# Altium project PHONE.PrjPCB
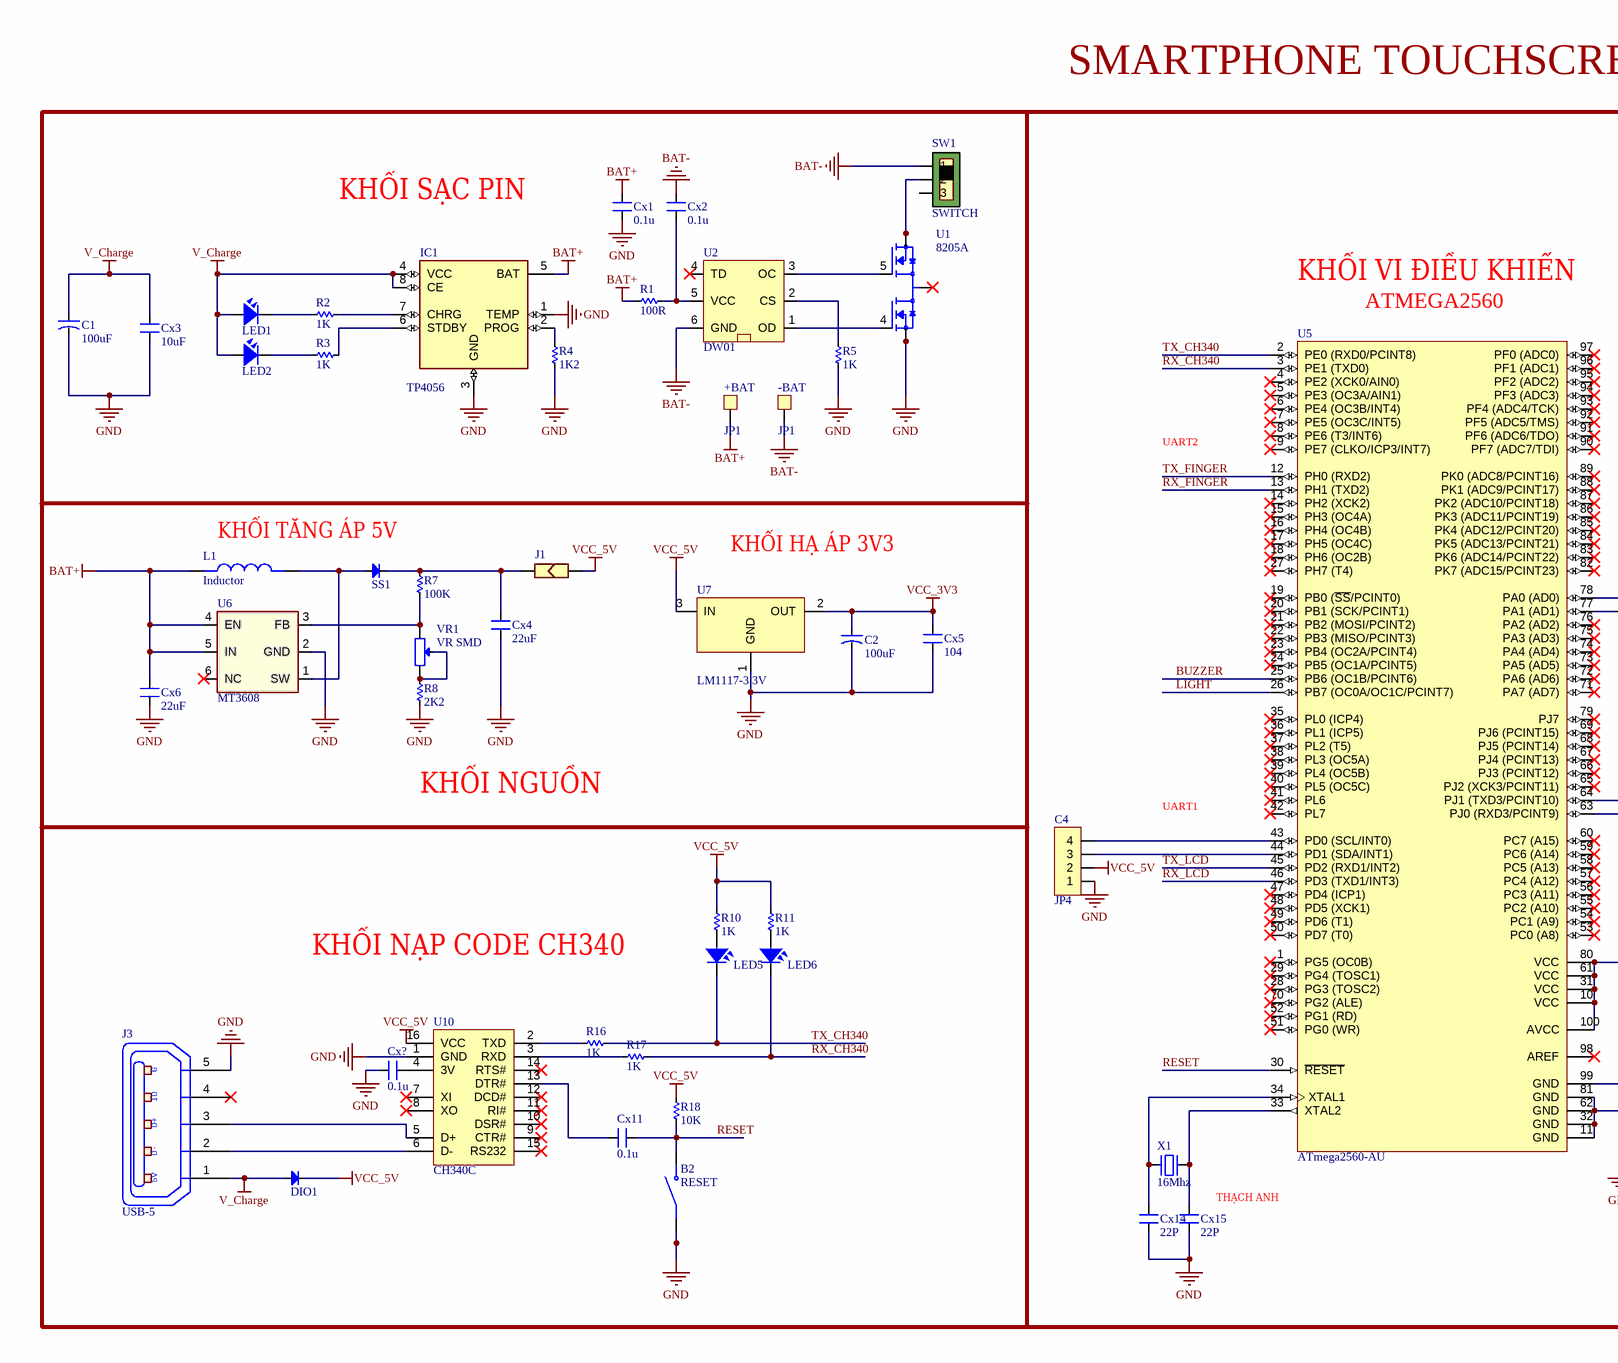
[diagram p0: SCH_PHONE.SchDoc, left]
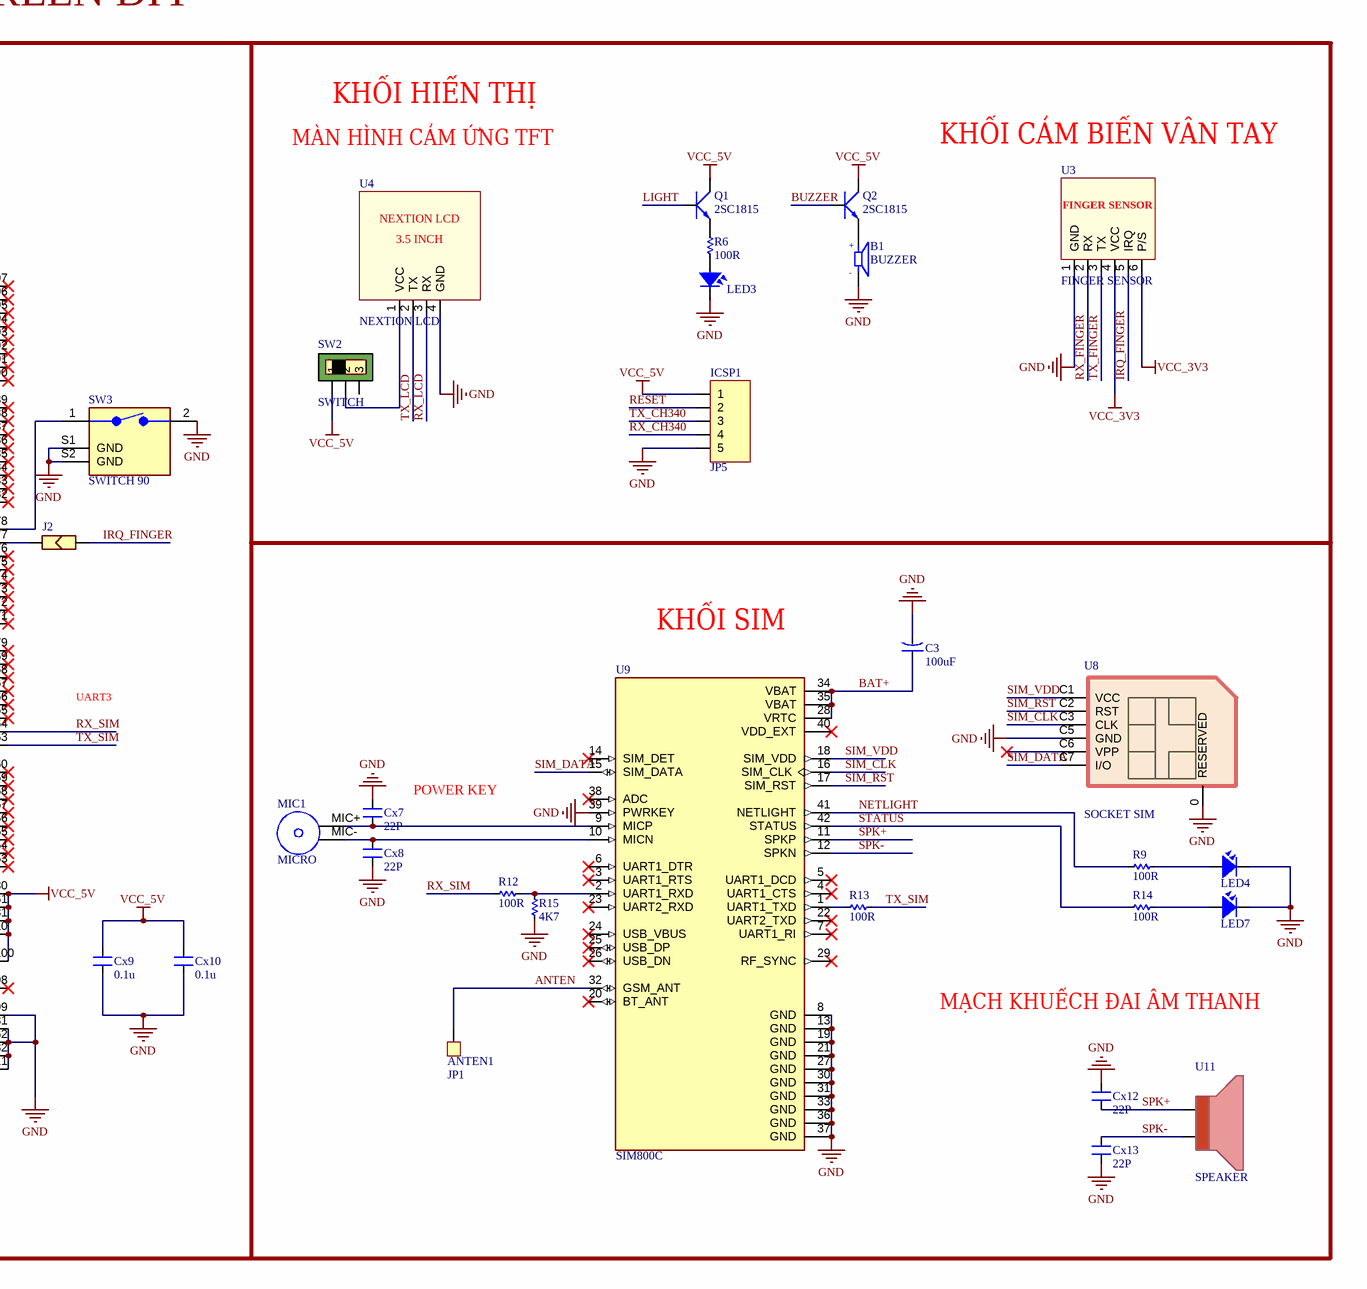
[diagram p1: SCH_PHONE.SchDoc, right]
1 sheet, 78 parts. Net scope: global (net labels, ports and power ports of the same name join across sheets).
Board files: PCB_PHONE_TFT.PcbDoc, TopPhone.PcbDoc, NextionLCD.PcbDoc

## Sheet SCH_PHONE.SchDoc: SMARTPHONE TOUCHSCREEN
size A2; Date: 03/02/2025; Author: Đậu Thành Trung; Organization: ORGANIZATION; Address1: ADDRESS 1; Address2: ADDRESS 2; Address3: ADDRESS 3; Address4: ADDRESS 4; Revision: -; Mail: dauthanhtrung.kma@gmail.com; Phone: 0868.24.2509

### Parts
+BAT  JP1  [JP1-SMD]
-BAT  JP1  [JP1-SMD]
?  (no value)  (no BOM)
ANTEN1  JP1  [JP1-SMD]
B1  BUZZER  [BUZZER]
B2  RESET  [BUTTON-SMD]
C1  100uF  [CAP-ALU-SMD-5x5.5x1.4]
C2  100uF  [CAP-ALU-SMD-5x5.5x1.4]
C3  100uF  [CAP-ALU-SMD-5x5.5x1.4]
C4  JP4  [JP4-C1T]
Cx1  0.1u  [CN-SMD-0805]
Cx2  0.1u  [CN-SMD-0805]
Cx3  10uF  [CN-SMD-0805]
Cx4  22uF  [CN-SMD-1206]
Cx5  104  [CN-SMD-0805]
Cx6  22uF  [CN-SMD-1206]
Cx7  22P  [CN-SMD-0805]
Cx8  22P  [CN-SMD-0805]
Cx9  0.1u  [CN-SMD-0805]
Cx10  0.1u  [CN-SMD-0805]
Cx11  0.1u  [CN-SMD-0805]
Cx12  22P  [CN-SMD-0805]
Cx13  22P  [CN-SMD-0805]
Cx14  22P  [CN-SMD-0805]
Cx15  22P  [CN-SMD-0805]
Cx?  0.1u  [CN-SMD-0805]
DIO1  Diode SMD  [DIO-SMD-123]  (value not drawn)
IC1  TP4056  [SOP8-TP4056]
ICSP1  JP5  [JP5-D1T]
J1  CONECT_PAD  [CONECT_PAD]  (value not drawn)
J2  CONECT_PAD  [CONECT_PAD]  (value not drawn)
J3  USB-5  [USB-M4]
L1  Inductor  [INDUCTOR]
LED1  LED  [LED-0805-Red]  (value not drawn)
LED2  LED  [LED-0805-Blue]  (value not drawn)
LED3  LED  [LED 3512]  (value not drawn)
LED4  LED  [LED-0805-Blue]  (value not drawn)
LED5  LED  [LED-0805-Blue]  (value not drawn)
LED6  LED  [LED-0805-Blue]  (value not drawn)
LED7  LED  [LED-0805-Blue]  (value not drawn)
MIC1  MICRO  [MICRO 6mm]
Q1  2SC1815  [SOT23-321]
Q2  2SC1815  [SOT23-321]
R1  100R  [RES-SMD-0805]
R2  1K  [RES-SMD-0805]
R3  1K  [RES-SMD-0805]
R4  1K2  [RES-SMD-0805]
R5  1K  [RES-SMD-0805]
R6  100R  [RES-SMD-0805]
R7  100K  [RES-SMD-0603]
R8  2K2  [RES-SMD-0603]
R9  100R  [RES-SMD-0805]
R10  1K  [RES-SMD-0805]
R11  1K  [RES-SMD-0805]
R12  100R  [RES-SMD-0805]
R13  100R  [RES-SMD-0805]
R14  100R  [RES-SMD-0805]
R15  4K7  [RES-SMD-0805]
R16  1K  [RES-SMD-0805]
R17  1K  [RES-SMD-0805]
R18  10K  [RES-SMD-0805]
SS1  Diode SMD  [DIO-SMD-106]  (value not drawn)
SW1  SWITCH  [SWITCH]
SW2  SWITCH  [SWITCH]
SW3  SWITCH 90  [SWITCH 90]
U1  8205A  [8205A]
U2  DW01  [SOT23-6]
U3  FINGER SENSOR  [FINGER SENSOR]
U4  NEXTION LCD  [JP4H]
U5  ATmega2560-AU  [TQFP100L]
U6  MT3608  [MT3608]
U7  LM1117-3.3V  [SOT223]
U8  SOCKET SIM  [SOCKET SIM 6P Pro]
U9  SIM800C  [SIM800C]
U10  CH340C  [SO16]
U11  SPEAKER  [SPEAKER SMD]
VR1  VR SMD  [VR SMD]
X1  16Mhz  [XTAL-RU49/4]

### Nets
BAT+: +BAT.1 C3.1 Cx1.1 Cx6.2 IC1.5(BAT) L1.1 R1.1 U6.4(EN) U6.5(IN) U9.28(VRTC) U9.34(VBAT) U9.35(VBAT)
BAT-: -BAT.1 Cx2.1 SW1.1 U2.6(GND)
GND: B1.M B2.1 C1.2 C2.2 C3.2 C4.1 Cx1.2 Cx3.1 Cx4.1 Cx5.1 Cx6.1 Cx7.2 Cx8.1 Cx9.1 Cx10.1 Cx12.2 Cx13.1 Cx14.1 Cx15.1 Cx?.2 IC1.1(TEMP) IC1.3(GND) ICSP1.5 J3.5(P5) LED3.2 LED4.2 LED7.2 R4.2 R5.1 R8.2 R15.1 SW3.2 SW3.S1(GND) SW3.S2(GND) U1.2(S1) U1.3(S1) U3.1(GND) U4.4(GND) U5.11(GND) U5.32(GND) U5.62(GND) U5.81(GND) U5.99(GND) U6.2(GND) U7.1(GND) U8.0(RESERVED) U8.C5(GND) U9.8(GND) U9.13(GND) U9.19(GND) U9.21(GND) U9.27(GND) U9.30(GND) U9.31(GND) U9.33(GND) U9.36(GND) U9.37(GND) U9.39(PWRKEY) U10.1(GND)
V_Charge: C1.1 Cx3.2 DIO1.1(A) IC1.4(VCC) IC1.8(CE) J3.1(P1) LED1.1 LED2.1
VCC_3V3: C2.1 Cx5.2 U3.4(VCC) U3.6(P/S) U7.2(OUT)
VCC_5V: C4.2 Cx9.2 Cx10.2 DIO1.2(K) ICSP1.1 J1.2 Q1.2(C) Q2.2(C) R10.1 R11.1 R18.1 SW2.1 U5.10(VCC) U5.31(VCC) U5.61(VCC) U5.80(VCC) U5.100(AVCC) U7.3(IN) U10.16(VCC)
ANTEN: ANTEN1.1 U9.32(GSM_ANT)
BUZZER: Q2.3(B) U5.25(PB6_(OC1B/PCINT6))
IRQ_FINGER: J2.2 U3.5(IRQ)
LIGHT: Q1.3(B) U5.26(PB7_(OC0A/OC1C/PCINT7))
NETLIGHT: R9.2 U9.41(NETLIGHT)
RESET: B2.2 Cx11.1 ICSP1.2 R18.2 U5.30(~{RESET})
RX_CH340: ICSP1.4 LED6.2 R17.1 U5.3(PE1_(TXD0))
RX_FINGER: U3.2(RX) U5.13(PH1_(TXD2))
RX_LCD: U4.3(RX) U5.46(PD3_(TXD1/INT3))
RX_SIM: R12.1 U5.64(PJ1_(TXD3/PCINT10))
SIM_CLK: U8.C3(CLK) U9.16(SIM_CLK)
SIM_DATA: U8.C7(I/O) U9.15(SIM_DATA)
SIM_RST: U8.C2(RST) U9.17(SIM_RST)
SIM_VDD: U8.C1(VCC) U9.18(SIM_VDD)
SPK+: Cx12.1 U9.11(SPKP) U11.0(SPK+)
SPK-: Cx13.2 U9.12(SPKN) U11.1(SPK-)
STATUS: R14.2 U9.42(STATUS)
TX_CH340: ICSP1.3 LED5.2 R16.1 U5.2(PE0_(RXD0/PCINT8))
TX_FINGER: U3.3(TX) U5.12(PH0_(RXD2))
TX_LCD: U4.2(TX) U5.45(PD2_(RXD1/INT2))
TX_SIM: R13.2 U5.63(PJ0_(RXD3/PCINT9))
NetB1_P: B1.P Q2.1(E)
NetC4_3: C4.3 U5.44(PD1_(SDA/INT1))
NetC4_4: C4.4 U5.43(PD0_(SCL/INT0))
NetCx2_2: Cx2.2 R1.2 U2.5(VCC)
NetCx4_2: Cx4.2 J1.1 R7.1 SS1.2(K)
NetCx7_1: Cx7.1 MIC1.MIC+ U9.9(MICP)
NetCx8_2: Cx8.2 MIC1.MIC- U9.10(MICN)
NetCx11_2: Cx11.2 U10.13(DTR#)
NetCx14_2: Cx14.2 U5.34(XTAL1) X1.1
NetCx15_2: Cx15.2 U5.33(XTAL2) X1.2
NetCx?_1: Cx?.1 U10.4(3V)
NetIC1_2: IC1.2(PROG) R4.1
NetIC1_6: IC1.6(STDBY) R3.1
NetIC1_7: IC1.7(CHRG) R2.1
NetJ2_1: J2.1 U5.77(PA1_(AD1))
NetJ3_2: J3.2(P2) U10.6(D-)
NetJ3_3: J3.3(P3) U10.5(D+)
NetL1_2: L1.2 SS1.1(A) U6.1(SW)
NetLED1_2: LED1.2 R2.2
NetLED2_2: LED2.2 R3.2
NetLED3_1: LED3.1 R6.1
NetLED4_1: LED4.1 R9.1
NetLED5_1: LED5.1 R10.2
NetLED6_1: LED6.1 R11.2
NetLED7_1: LED7.1 R14.1
NetQ1_1: Q1.1(E) R6.2
NetR5_2: R5.2 U2.2(CS)
NetR7_2: R7.2 U6.3(FB) VR1.1
NetR8_1: R8.1 VR1.2 VR1.3
NetR12_2: R12.2 R15.2 U9.2(UART1_RXD)
NetR13_1: R13.1 U9.1(UART1_TXD)
NetR16_2: R16.2 U10.2(TXD)
NetR17_2: R17.2 U10.3(RXD)
NetSW1_2: SW1.2 U1.6(S2) U1.7(S2)
NetSW2_2: SW2.2 U4.1(VCC)
NetSW3_1: SW3.1 U5.78(PA0_(AD0))
NetU1_1: U1.1(D12) U1.8(D12)
NetU1_4: U1.4(G1) U2.1(OD)
NetU1_5: U1.5(G2) U2.3(OC)

Not connected (* = marked no-connect by the designer): J3 4(P4)*; SW1 3; SW2 3; U2 4(TD)*; U5 1(PG5_(OC0B))* 4(PE2_(XCK0/AIN0))* 5(PE3_(OC3A/AIN1))* 6(PE4_(OC3B/INT4))* 7(PE5_(OC3C/INT5))* 8(PE6_(T3/INT6))* 9(PE7_(CLKO/ICP3/INT7))* 14(PH2_(XCK2))* 15(PH3_(OC4A))* 16(PH4_(OC4B))* 17(PH5_(OC4C))* 18(PH6_(OC2B))* 19(PB0_(~{SS}/PCINT0))* 20(PB1_(SCK/PCINT1))* 21(PB2_(MOSI/PCINT2))* 22(PB3_(MISO/PCINT3))* 23(PB4_(OC2A/PCINT4))* 24(PB5_(OC1A/PCINT5))* 27(PH7_(T4))* 28(PG3_(TOSC2))* 29(PG4_(TOSC1))* 35(PL0_(ICP4))* 36(PL1_(ICP5))* 37(PL2_(T5))* 38(PL3_(OC5A))* 39(PL4_(OC5B))* 40(PL5_(OC5C))* 41(PL6)* 42(PL7)* 47(PD4_(ICP1))* 48(PD5_(XCK1))* 49(PD6_(T1))* 50(PD7_(T0))* 51(PG0_(WR))* 52(PG1_(RD))* 53(PC0_(A8))* 54(PC1_(A9))* 55(PC2_(A10))* 56(PC3_(A11))* 57(PC4_(A12))* 58(PC5_(A13))* 59(PC6_(A14))* 60(PC7_(A15))* 65(PJ2_(XCK3/PCINT11))* 66(PJ3_(PCINT12))* 67(PJ4_(PCINT13))* 68(PJ5_(PCINT14))* 69(PJ6_(PCINT15))* 70(PG2_(ALE))* 71(PA7_(AD7))* 72(PA6_(AD6))* 73(PA5_(AD5))* 74(PA4_(AD4))* 75(PA3_(AD3))* 76(PA2_(AD2))* 79(PJ7)* 82(PK7_(ADC15/PCINT23))* 83(PK6_(ADC14/PCINT22))* 84(PK5_(ADC13/PCINT21))* 85(PK4_(ADC12/PCINT20))* 86(PK3_(ADC11/PCINT19))* 87(PK2_(ADC10/PCINT18))* 88(PK1_(ADC9/PCINT17))* 89(PK0_(ADC8/PCINT16))* 90(PF7_(ADC7/TDI))* 91(PF6_(ADC6/TDO))* 92(PF5_(ADC5/TMS))* 93(PF4_(ADC4/TCK))* 94(PF3_(ADC3))* 95(PF2_(ADC2))* 96(PF1_(ADC1))* 97(PF0_(ADC0))* 98(AREF)*; U6 6(NC)*; U8 C6(VPP)*; U9 3(UART1_RTS)* 4(UART1_CTS)* 5(UART1_DCD)* 6(UART1_DTR)* 7(UART1_RI)* 14(SIM_DET)* 20(BT_ANT)* 22(UART2_TXD)* 23(UART2_RXD)* 24(USB_VBUS)* 25(USB_DP)* 26(USB_DN)* 29(RF_SYNC)* 38(ADC)* 40(VDD_EXT)*; U10 7(XI)* 8(XO)* 9(CTR#)* 10(DSR#)* 11(RI#)* 12(DCD#)* 14(RTS#)* 15(RS232)*

### Notes on the sheet
- SMARTPHONE TOUCHSCREEN DIY
- KHỐI SẠC PIN
- KHỐI HIỂN THỊ
- MÀN HÌNH CẢM ỨNG TFT
- KHỐI CẢM BIẾN VÂN TAY
- KHỐI VI ĐIỀU KHIỂN
- (near U5) ATMEGA2560
- UART2
- KHỐI TĂNG ÁP 5V
- KHỐI HẠ ÁP 3V3
- KHỐI SIM
- KHỐI NGUỒN
- UART1
- UART3
- POWER KEY
- KHỐI NẠP CODE CH340
- MẠCH KHUẾCH ĐAI ÂM THANH
- (near Cx15) THẠCH ANH
- Project:
- Date:
- Email:
- Designed by:
- Phone:
- (in symbol BUZZER) +; -
- (in symbol NEXTION LCD) 3.5 INCH
- (in symbol USB-5) G; ID; D+; D-; 5V

### Library data of the parts
? = Title Block
B2 = Button-SMD
C1-C3 = CN-ALU-SMD: Polarized Capacitor (Axial); Published: 8-Jun-2000; LatestRevisionDate: 17-Jul-2002; LatestRevisionNote: Re-released for DXP Platform.; PackageReference: POLAR0.8; Publisher: Altium Limited
C4 = JP4: WR-PHD 2.54 mm Angled Socket Header; Manufacturer: W¨¹rth Elektronik eiSos GmbH; partNo: 613004143121; ComponentLink1 Description: Manufacturer; ComponentLink2 Description: Datasheet; NoPins: 04; Created Date: 29 March 2013; ComponentLink1URL: http://www.we-online.com; ComponentLink2URL: http://katalog.we-online.de/em/datasheet/6130xx143121.pdf; Created by: Karrer Zheng
Cx1-Cx15 Cx? = CN: Value: 33pF
DIO1 SS1 = Diode SMD: Default Diode; Code - JEDEC: DO-214-AB; Value: 1N5007; Published: 8-Jun-2000; Revision: July-2002: Re-released for DXP Platform.; Publisher: Altium Limited
ICSP1 = JP5: WR-PHD 2.54 mm Angled Socket Header; Manufacturer: W¨¹rth Elektronik eiSos GmbH; partNo: 613005143121; ComponentLink1 Description: Manufacturer; ComponentLink2 Description: Datasheet; NoPins: 05; Created Date: 29 March 2013; ComponentLink1URL: http://www.we-online.com; ComponentLink2URL: http://katalog.we-online.de/em/datasheet/6130xx143121.pdf; Created by: Karrer Zheng
J3 = USB-5: Manufacturer: FCI; Manufacturer Part Number: 10118193-0001LF; Connector Type: USB - micro B; Number of Contacts: 5; Gender: Receptacle; Specifications: USB 2.0; .Creator: MM; .Checked PCB: RF; Supplier 1: Digi-Key; RoHS: RoHS Compliant; Category: Connectors, Interconnects; Stock 1: 28642; Pricing 1: 1=0.46, 10=0.433, 25=0.3712, 50=0.3156, 100=0.3032, 250=0.27224, 500=0.25988 (USD); Packaging: Cut Tape (CT); Mounting Type: Surface Mount, Right Angle, Horizontal; Features: Shielded, Solder Retention; Ingress Protection: -; ComponentLink1URL: http://portal.fciconnect.com/Comergent//fci/drawing/10118193.pdf; ComponentLink1Description: http://portal.fciconnect.com/Comergent//fci/drawing/10118193.pdf; Supplier Part Number 1: 609-4616-1-ND; .Checked SCH: MM
LED1-LED7 = LED SMD: Value: LED 3 - 5 ly 2 Colour
Q1 Q2 = 2SC1815: NPN 600mW, ECB; Value: C1815
R1-R18 = Res-SMD: Resistor; Manufacturer: Generic Components; Class: Passive; Published: 08/06/2000; Publisher: Altium Hobart Technology Centre
SW3 = SWITCH 90: Tact Switch 90 degree
U2 = DW01: Lithium Protection DW01
U5 = ATmega2560-AU: 8-bit AVR Microcontroller, 4.5-5.5V, 256KB Flash, 4KB EEPROM, 8KB SRAM, 86 GPIO pins, 100-pin TQFP, Industrial Grade (-40°C to 85°C), Pb-Free; Supplier 1: Digi-Key; Supplier Part Number 1: ATMEGA2560-16AUR-ND
U6 = MT3608: MF: Aerosemi Technology Co., Ltd; Package: Package Analog Devices; Availability: Unavailable; Value: *; MP: MT3608; SnapEDA_Link: https://www.snapeda.com/parts/MT3608/Aerosemi%20Technology%20Co.%2C%20Ltd/view-part/3218014/?ref=snap; Price: None
U7 = LM1117: 800mA Low-Dropout Linear Regulator; Creator: Nguyen Ba Bien; Website: http://group3i.net
U10 = CH340G: High and Low Side Driver; Note: Pins 4, 8 and 14 are not connected; Published: 8-Jun-2000; LatestRevisionDate: 04-Mar-2005; LatestRevisionNote: Stylized 3D Model Added.; DatasheetVersion: PD60147J; PackageReference: PDIP14; Publisher: Altium Limited; PackageDescription: DIP; 14 Leads; Row Spacing 7.62 mm; Pitch 2.54 mm; ComponentLink1Description: Manufacturer Link; ComponentLink1URL: http://www.irf.com/; ComponentLink2Description: Datasheet; ComponentLink2URL: http://www.irf.com/product-info/datasheets/data/ir2110.pdf
VR1 = VR SMD: MP: EVM3ESX50B12; MF: Panasonic; SnapEDA_Link: https://www.snapeda.com/parts/EVM3ESX50B12/Panasonic/view-part/558669/?ref=snap; Value: *; Price: None; Package: None; Availability: Unavailable
X1 = XT2: Crystal, 32.768 KHz, -40 to 85 degC, 3.2 x 1.5 x 0.9 mm SMD; Value: 4Mhz